# Altium schematic sheet BUZZ.SchDoc
size A4
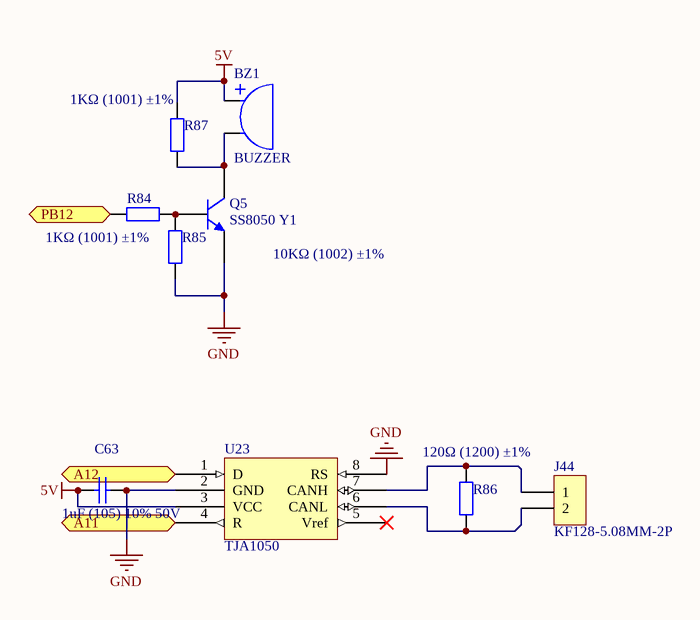
[diagram p0: BUZZ.SchDoc]

## Parts
BZ1  BUZZER  [BUZZER-D12.0X8.5-6.5-0.8]
C63  1uF (105) 10% 50V  [0805_C]
J44  KF128-5.08MM-2P  [WJ2EDGR-5.08-2]
Q5  SS8050 Y1  [SOT-23(SOT-23-3)]
R84  1KΩ (1001) ±1%  [0805_R]
R85  10KΩ (1002) ±1%  [0805_R]
R86  120Ω (1200) ±1%  [0805_R]
R87  1KΩ (1001) ±1%  [0805_R]
U23  TJA1050  [SOP-8]

## Ports
A11, A12, PB12

## Nets
5V: BZ1.1 C63.1 R87.2 U23.3(VCC)
GND: C63.2 Q5.2(E) R85.1 U23.2(GND) U23.8(RS)
A11: U23.4(R) ; port A11
A12: U23.1(D) ; port A12
PB12: R84.1 ; port PB12
NetBZ1_2: BZ1.2 Q5.3(C) R87.1
NetJ44_1: J44.1 R86.2 U23.7(CANH)
NetJ44_2: J44.2 R86.1 U23.6(CANL)
NetQ5_1: Q5.1(B) R84.2 R85.2

Not connected (* = marked no-connect by the designer): U23 5(Vref)*

## Library data of the parts
C63 = 0805 1uF (105) 10% 50V: 贴片电容; ComponentLink1Description: 供应商链接; ComponentLink1URL: http://www.szlcsc.com/product/details_29074.html; Package: 0805; Supplier: LC; SuppliersPartNumber: C28323
J44 = KF128-5.08MM-2P: 接线端子; ComponentLink1URL: https://detail.tmall.com/item.htm?spm=a1z10.5-b.w4011-14865958799.193.B0p41N&id=45905508377&rn=e90e7252b5175cd006380c5c01151190&abbucket=9; price: 0.5; Supplier: Farpu; SuppliersPartNumber: *; Manufacturer: *; ComponentLink1Description: 供应商链接
Q5 = SOT-23 SS8050 Y1: 三极管; ComponentLink1Description: 供应商链接; ComponentLink1URL: http://www.szlcsc.com/product/details_2507.html; Package: SOT-23; Supplier: LC; SuppliersPartNumber: C2150
R84 R87 = 0805 1KΩ (1001) 1%: 贴片电阻; ComponentLink1Description: 供应商链接; ComponentLink1URL: http://www.szlcsc.com/product/details_18201.html; Package: 0805; Supplier: LC; SuppliersPartNumber: C17513
R85 = 0805 10KΩ (1002) 1%: 贴片电阻; ComponentLink1Description: 供应商链接; ComponentLink1URL: http://www.szlcsc.com/product/details_18102.html; Package: 0805; Supplier: LC; SuppliersPartNumber: C17414
R86 = 0805 120Ω (1200) 1%: 贴片电阻; ComponentLink1Description: 供应商链接; ComponentLink1URL: http://www.szlcsc.com/product/details_18125.html; Package: 0805; Supplier: LC; SuppliersPartNumber: C17437
U23 = SN65HVD230D